# Altium schematic sheet AVR Programmer.SchDoc
size A
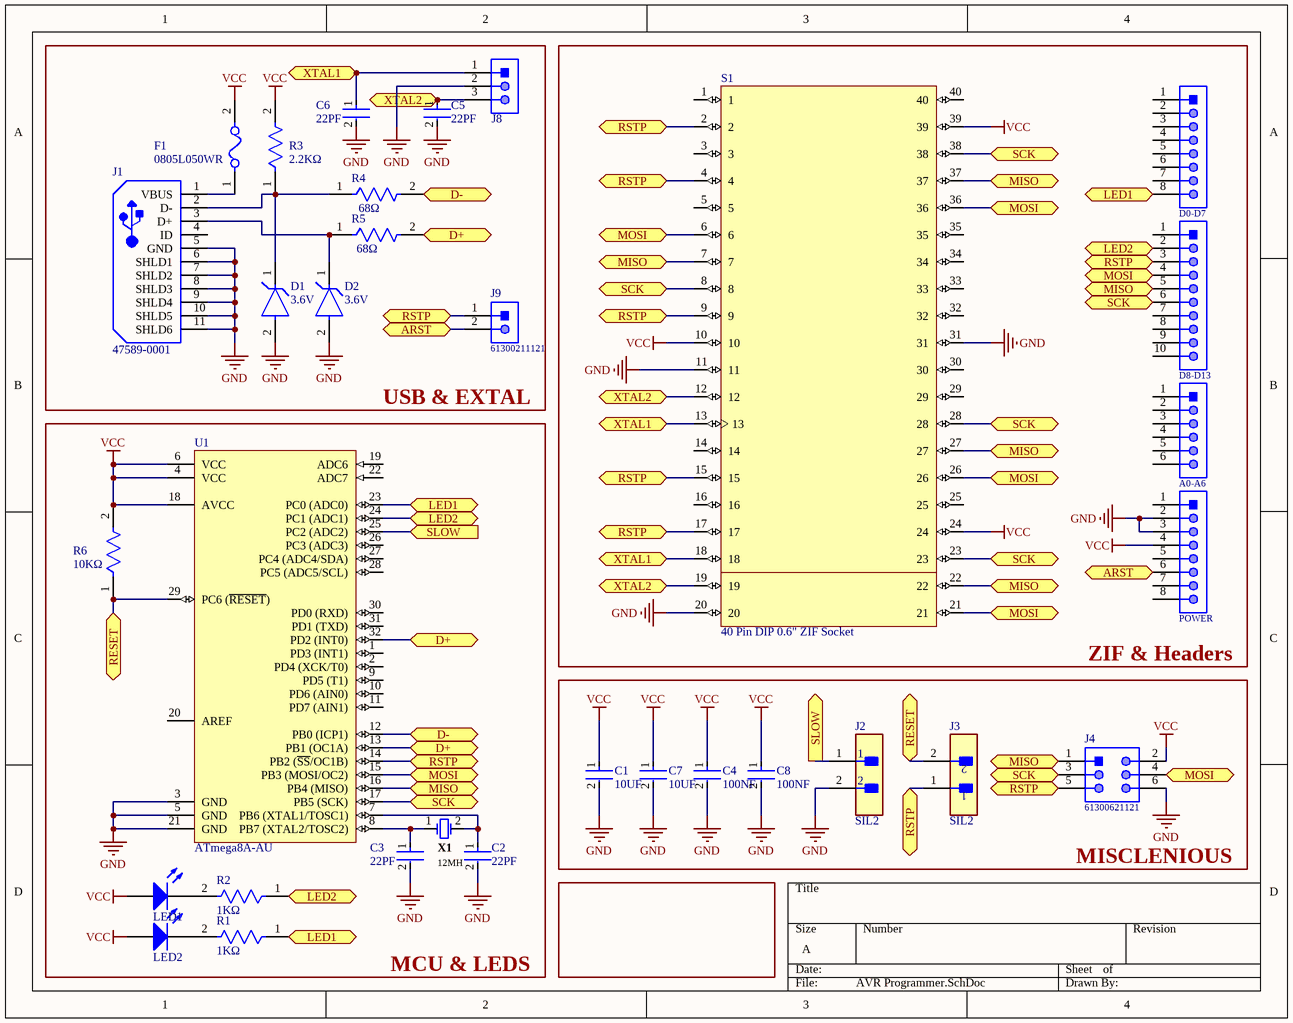
[diagram p0: AVR Programmer.SchDoc]

## Parts
(Parts that share a designator on the sheet are numbered #1, #2 ... from top to bottom, then left to right.)
C1  10UF  [FP-C0805C-DN-MFG]
C2  22PF  [FP-CC0805-0_85-MFG]
C3  22PF  [FP-CC0805-0_85-MFG]
C4  100NF  [FP-C0805C-DN-MFG]
C5  22PF  [FP-CC0805-0_85-MFG]
C6  22PF  [FP-CC0805-0_85-MFG]
C7  10UF  [FP-C0805C-DN-MFG]
C8  100NF  [FP-C0805C-DN-MFG]
D1  3.6V  [FP-6_560-5005_01-4-MFG]
D2  3.6V  [FP-6_560-5005_01-4-MFG]
F1  0805L050WR  [FP-0805L-MFG]
J1  47589-0001  [MOLX-47589-0001_V]
J2  SIL2  [FP-M22-2510205-MFG]
J3  SIL2  [FP-M22-2510205-MFG]
J4#1  D0-D7  [61300811121]
J4#2  61300621121  [61300621121]
J5  D8-D13  [61301011121]
J6  A0-A6  [61300611121]
J7  POWER  [61300811121]
J8  61300311121  [61300311121]  (value not drawn)
J9  61300211121  [61300211121]
LED1  (no value)  [0805_A]
LED2  150080SS75000  [0805_A]  (value not drawn)
R1  1KΩ  [FP-CRCW0805-e3-IPC_C]
R2  1KΩ  [FP-CRCW0805-e3-IPC_C]
R3  2.2KΩ  [FP-CRCW0805-e3-IPC_C]
R4  68Ω  [FP-CRCW0805-e3-IPC_C]
R5  68Ω  [FP-CRCW0805-e3-IPC_C]
R6  10KΩ  [FP-CRCW0805-e3-IPC_C]
S1  40 Pin DIP 0.6" ZIF Socket  [40P6]
U1  ATmega8A-AU  [32A_N]
X1  12MH  [FOX-FOXSLF-2_V]

## Blocks framed on the sheet
USB & EXTAL: C5 C6 D1 D2 F1 J1 J8 J9 R3-R5
ZIF & Headers: J4#1 J5-J7 S1
MCU & LEDS: C2 C3 LED1 LED2 R1 R2 R6 U1 X1
MISCLENIOUS: C1 C4 C7 C8 J2 J3 J4#2

## Ports
ARST (bidir), D+ (bidir), D- (bidir), LED1 (bidir), LED2 (bidir), MISO (bidir), MOSI (bidir), RESET (bidir), RSTP (bidir), SCK (bidir), SLOW (in), SLOW (out), XTAL1 (bidir), XTAL2 (bidir)

## Nets
GND: C1.2 C2.2 C3.2 C4.2 C5.2 C6.2 C7.2 C8.2 D1.2(A) D2.2(A) J1.5(GND) J1.6(SHLD1) J1.7(SHLD2) J1.8(SHLD3) J1.9(SHLD4) J1.10(SHLD5) J1.11(SHLD6) J2.2 J4#2.6 J7.2 J7.3 J8.2 S1.11 S1.20 S1.31 U1.3(GND) U1.5(GND) U1.21(GND)
VCC: C1.1 C4.1 C7.1 C8.1 F1.2 J4#2.2 J7.4 LED1.2(A) LED2.2(A) R3.2 R6.2 S1.10 S1.24 S1.39 U1.4(VCC) U1.6(VCC) U1.18(AVCC)
ARST: J7.6 J9.2 ; port ARST
D+: R5.2 U1.13(PB1_(OC1A)) U1.32(PD2_(INT0)) ; port D+
D-: R4.2 U1.12(PB0_(ICP1)) ; port D-
LED1: J4#1.8 R1.1 U1.23(PC0_(ADC0)) ; port LED1
LED2: J5.2 R2.1 U1.24(PC1_(ADC1)) ; port LED2
MISO: J4#2.1 J5.5 S1.7 S1.22 S1.27 S1.37 U1.16(PB4_(MISO)) ; port MISO
MOSI: J4#2.4 J5.4 S1.6 S1.21 S1.26 S1.36 U1.15(PB3_(MOSI/OC2)) ; port MOSI
RESET: J3.2 R6.1 U1.29(PC6_(~{RESET})) ; port RESET
RSTP: J3.1 J4#2.5 J5.3 J9.1 S1.2 S1.4 S1.9 S1.15 S1.17 U1.14(PB2_(~{SS}/OC1B)) ; port RSTP
SCK: J4#2.3 J5.6 S1.8 S1.23 S1.28 S1.38 U1.17(PB5_(SCK)) ; port SCK
SLOW: J2.1 U1.25(PC2_(ADC2)) ; port SLOW
XTAL1: C6.1 J8.1 S1.13 S1.18 ; port XTAL1
XTAL2: C5.1 J8.3 S1.12 S1.19 ; port XTAL2
NetC2_1: C2.1 U1.7(PB6_(XTAL1/TOSC1)) X1.2
NetC3_1: C3.1 U1.8(PB7_(XTAL2/TOSC2)) X1.1
NetD1_1: D1.1(C) J1.2(D-) R3.1 R4.1
NetD2_1: D2.1(C) J1.3(D+) R5.1
NetF1_1: F1.1 J1.1(VBUS)
NetLED1_1: LED1.1(K) R2.2
NetLED2_1: LED2.1(K) R1.2

Not connected (* = marked no-connect by the designer): J1 4(ID); J4#1 1 2 3 4 5 6 7; J5 1 7 8 9 10; J6 1 2 3 4 5 6; J7 1 5 7 8; S1 1 3 5 14 16 25 29 30 32 33 34 35 40; U1 1(PD3_(INT1)) 2(PD4_(XCK/T0)) 9(PD5_(T1)) 10(PD6_(AIN0)) 11(PD7_(AIN1)) 19(ADC6) 20(AREF) 22(ADC7) 26(PC3_(ADC3)) 27(PC4_(ADC4/SDA)) 28(PC5_(ADC5/SCL)) 30(PD0_(RXD)) 31(PD1_(TXD))

## Library data of the parts
C1 C7 = CMP-2007-00235-2: CAP CER 1000PF 50V C0G/NP0 0805; Manufacturer: KEMET; Manufacturer Part Number: C0805C102J5GACTU; Value: 1,000 pF; Temperature Characteristic: C0G; Material: Ceramic; Temperature Coefficient: 30ppm/°C; Tolerance: 0.05; Automotive: No; Voltage Rating: 50 V; Device Class L1: Passive Components; Digikey Description: CAP CER 1000PF 50V C0G/NP0 0805; Lead Free: Yes; Capacitance: 1,000 pF; Package: C0805C-DN; RoHS: TRUE; Temperature Range High: +125°C; Height: 0.88mm; Ipc Land Pattern Name: CAPC200125X78; Category: Cap; ComponentLink2URL: https://content.kemet.com/datasheets/KEM_C1003_C0G_SMD.pdf; Device Class L2: Capacitors; ComponentLink2Description: Datasheet; Temperature: -55°C to +125°C; Octopart: https://octopart.com/c0805c102j5gactu-kemet-97757; Mouser Description: Multilayer Ceramic Capacitors MLCC - SMD/SMT 50volts 1000pF C0G 5%; Device Class L3: Ceramic Capacitors; Temperature Range Low: -55°C
C2 C3 C5 C6 = CMP-2100-03606-3: CAP CER 0.1UF 50V X7R 0805; Manufacturer Part Number: CC0805KRX7R9BB104; Manufacturer: Yageo; Tolerance: 0.1; Capacitance: 100 nF; Value: 100 nF; Material: Ceramic; Device Class L1: Passive Components; ComponentLink2Description: Datasheet; Package: CC0805-0.85; Digikey Description: CAP CER 0.1UF 50V X7R 0805; Device Class L3: Ceramic Capacitors; Temperature: -30°C to +85°C; Temperature Characteristic: X7R; Voltage Rating: 50 V; Height: 0.95mm; RoHS: TRUE; Ipc Land Pattern Name: CAPC200125X85; Device Class L2: Capacitors; Category: Cap; Temperature Range Low: -30°C; Temperature Range High: +85°C; Mouser Description: Multilayer Ceramic Capacitors MLCC - SMD/SMT 100nF 50V X7R 10%; Footprint Url: http://www.yageo.com/exep/pages/download/literatures/UPY-C_GEN_24.pdf; Automotive: No; Octopart: https://octopart.com/cc0805krx7r9bb104-yageo-192993; Lead Free: Yes; ComponentLink2URL: http://www.yageo.com/documents/recent/UPY-GPHC_Y5V_6.3V-to-50V_8.pdf
C4 C8 = CMP-2007-00403-2: CAP CER 680PF 50V X7R 0805; Manufacturer Part Number: C0805C681K5RACTU; Manufacturer: KEMET; Material: Ceramic; Temperature Coefficient: 30ppm/°C; Tolerance: 0.1; Voltage Rating: 50 V; Temperature Range High: +125°C; Temperature Characteristic: X7R; Value: 680 pF; Mouser Description: 0805 C 680pF Ceramic Multilayer Capacitor; 50 VDC; +125degC; X7R Dielec; +/-10%; Automotive: No; Octopart: https://octopart.com/c0805c681k5ractu-kemet-124671; RoHS: TRUE; Device Class L2: Capacitors; Height: 0.88mm; Capacitance: 680 pF; Category: Cap; Ipc Land Pattern Name: CAPC200125X78; Lead Free: Yes; Temperature: -55°C to +125°C; Package: C0805C-DN; Device Class L3: Ceramic Capacitors; Temperature Range Low: -55°C; ComponentLink2URL: https://content.kemet.com/datasheets/KEM_C1003_C0G_SMD.pdf; ComponentLink2Description: Datasheet; Digikey Description: CAP CER 680PF 50V X7R 0805; Device Class L1: Passive Components
D1 D2 = CMP-02541-000010-1: DIODE ZENER 5.1V 500MW SOD80; Manufacturer: Vishay Semiconductor Diodes Division; Manufacturer Part Number: TZMC5V1-GS08; Zener Impedance: 60Ω; Reverse Voltage: 1V; Max Reverse Leakage Current: 0.1uA; Max Junction Temp: +175°C; Forward Current: 200mA; Automotive Grade: Grade 0; Max Zener Voltage: 5.4V; Device Class L2: Diodes; RoHS: TRUE; Octopart: https://octopart.com/tzmc5v1-gs08-vishay-1003274; ComponentLink2Description: Datasheet; Mouser Description: TZM Series 500 mW 5.1 V 200 mA Small Signal Zener Diode - SOD-80; Height: 1.6mm; Nom Zener Voltage: 5.1V; Lead Free: Yes; Category: Diode; Power Dissipation: 500mW; Device Class L1: Discrete Semiconductors; Package: 6.560-5005.01-4; ComponentLink2URL: https://www.vishay.com/docs/84122/tzm.pdf; Digikey Description: DIODE ZENER 5.1V 500MW SOD80; Automotive: Yes; Device Class L3: Zener Diodes; Temperature Range High: +175°C; Temperature: to +175°C
F1 = CMP-08606-000023-1: PTC RESET FUSE 6V 500MA 0805; Manufacturer: Littelfuse Inc.; Current Rating: 100A; Hold Current: 0.5A; Value: 0.15-0.85Ω; Trip Time: 0.1s; Trip Current: 1A; Device Class L2: PTC Resettable Fuses; Manufacturer Part Number: 0805L050WR; Digikey Description: PTC RESET FUSE 6V 500MA 0805; ComponentLink2URL: https://www.littelfuse.com/~/media/electronics/datasheets/resettable_ptcs/littelfuse_ptc_0805l_datasheet.pdf.pdf; Package: 0805L; RoHS: TRUE; Temperature Range Low: -40°C; Octopart: https://octopart.com/0805l050wr-littelfuse-673858; Resistance: 0.15-0.85Ω; ComponentLink2Description: Datasheet; Category: Fuse; Height: 1.25mm; Mouser Description: PTC Resettable Fuse 0.5A(hold) 1A(trip) 6VDC 100A 0.5W 0.1s 0.15Ohm SMD Solder Pad 0805 T/R; Ambient Temperature Range High: +85°C; Automotive: No; Device Class L3: unset; Lead Free: Yes; Temperature: -40°C to +85°C; Voltage Rating: 6V; Ambient Temperature Range Low: -40°C; Temperature Range High: +85°C; Device Class L1: Circuit Protection
J1 = CMP-2000-05610-1: Right Angle Female Type AB Micro USB Connector, 30 V, 1.8 A, -30 to 85 degC, RoHS, Tape and Reel; Number of Ports: 1Port; Current Rating: 1.8A; Brand: Molex; Connector Type: MicroUSBTypeABreceptacle; Number of Contacts: 5Contact; Voltage Rating: 30VAC; Color: Black; Product: MicroUSBTypeABConnectors; Package URL: http://www.molex.com/pdm_docs/sd/475890001_sd.pdf; Contact Plating: Gold; Datasheet URL: http://www.molex.com/webdocs/datasheets/pdf/en-us/0475890001_IO_CONNECTORS.pdf; Operating Temperature Range: -20Cto+85C; Termination Style: SMD/SMT; Mounting Angle: Right; Package Reference: 47589-0001; Gender: Female; Package Description: Micro USB Connector, Pitch 0.65 mm, 5 Positions, Body 7.5 x 5.6 mm; Mounting Technology: SurfaceMount; Contact Material: CopperAlloy; Packaging: Reel; RoHS: True; Standard: USB; Manufacturer URL: http://www.molex.com/; Manufacturer: Molex; Datasheet Version: 12/2016; Product Category: USBConnectors; Series: 47589
J2 J3 = CMP-15831-000005-1: CONN HEADER VERT 2POS 2MM; Manufacturer: Harwin; Manufacturer Part Number: M22-2510205; Conn Gender: Male; Current Rating: 2A; Number Of Contacts: 2; Conn Orientation: Vertical; Temperature Range Low: -40°C; Device Class L1: Connectors; ComponentLink2URL: https://cdn.harwin.com/pdfs/C018XX_M22_Series_Connectors.pdf; Temperature Range High: +105°C; Pitch: 2mm; Number Of Rows: 1; Temperature: -40°C to +105°C; Automotive: No; Device Class L3: unset; Octopart: https://octopart.com/m22-2510205-harwin-2538221; Mouser Description: Headers & Wire Housings 2 PIN SIL VERTICAL GOLD PIN HEADER; Height: 5.45mm; Category: Conn; Digikey Description: CONN HEADER VERT 2POS 2MM; Contact Material: Gold,Nickel; Lead Free: Yes; ComponentLink2Description: Datasheet; Device Class L2: Headers and Wire Housings; Package: 0; Footprint Url: https://cdn.harwin.com/pdfs/M22-251.pdf; RoHS: TRUE
J4#1 J7 = CMP-1502-01076-1: THT Vertical Pin Header WR-PHD, Pitch 2.54 mm, Single Row, 8 pins; Manufacturer: Wurth Elektronik; Rated Current: 3A; Pin Number: 8; Working Voltage: 250VAC; Gender: Male; Contact Resistance: 20mOhm; Pitch: 2.54mm; Withstanding Voltage: 500VAC; Publisher: WurthElektronik; Operating Temperature: -40to105degC; Orientation: Vertical; Row Number: Single; Part Number: 61300811121; Package Reference: 61300811121; Mounting Technology: THT; Packaging: Bag; Manufacturer URL: http://www.we-online.de; Datasheet URL: https://katalog.we-online.de/em/datasheet/6130xx11121.pdf
J4#2 = CMP-1502-01072-1: THT Vertical Pin Header WR-PHD, Pitch 2.54 mm, Dual Row, 6 pins; Manufacturer: Wurth Elektronik; Contact Resistance: 20mOhm; Withstanding Voltage: 500VAC; Pin Number: 6; Gender: Male; Pitch: 2.54mm; Working Voltage: 250VAC; Rated Current: 3A; Packaging: Bag; Row Number: Dual; Manufacturer URL: http://www.we-online.de; Part Number: 61300621121; Operating Temperature: -40to105degC; Mounting Technology: THT; Package Reference: 61300621121; Datasheet URL: https://katalog.we-online.de/em/datasheet/6130xx21121.pdf; Orientation: Vertical; Publisher: WurthElektronik
J5 = CMP-1502-01082-1: THT Vertical Pin Header WR-PHD, Pitch 2.54 mm, Single Row, 10 pins; Manufacturer: Wurth Elektronik; Contact Resistance: 20mOhm; Rated Current: 3A; Pitch: 2.54mm; Gender: Male; Pin Number: 10; Working Voltage: 250VAC; Withstanding Voltage: 500VAC; Manufacturer URL: http://www.we-online.de; Operating Temperature: -40to105degC; Datasheet URL: https://katalog.we-online.de/em/datasheet/6130xx11121.pdf; Row Number: Single; Orientation: Vertical; Part Number: 61301011121; Packaging: Bag; Package Reference: 61301011121; Mounting Technology: THT; Publisher: WurthElektronik
J6 = CMP-1502-01070-1: THT Vertical Pin Header WR-PHD, Pitch 2.54 mm, Single Row, 6 pins; Manufacturer: Wurth Elektronik; Gender: Male; Pin Number: 6; Pitch: 2.54mm; Working Voltage: 250VAC; Rated Current: 3A; Withstanding Voltage: 500VAC; Contact Resistance: 20mOhm; Operating Temperature: -40to105degC; Packaging: Bag; Datasheet URL: https://katalog.we-online.de/em/datasheet/6130xx11121.pdf; Package Reference: 61300611121; Mounting Technology: THT; Publisher: WurthElektronik; Part Number: 61300611121; Manufacturer URL: http://www.we-online.de; Row Number: Single; Orientation: Vertical
J8 = CMP-1502-01062-1: THT Vertical Pin Header WR-PHD, Pitch 2.54 mm, Single Row, 3 pins; Manufacturer: Wurth Elektronik; Withstanding Voltage: 500VAC; Working Voltage: 250VAC; Rated Current: 3A; Pitch: 2.54mm; Pin Number: 3; Gender: Male; Contact Resistance: 20mOhm; Package Reference: 61300311121; Manufacturer URL: http://www.we-online.de; Datasheet URL: https://katalog.we-online.de/em/datasheet/6130xx11121.pdf; Operating Temperature: -40to105degC; Part Number: 61300311121; Orientation: Vertical; Packaging: Bag; Row Number: Single; Mounting Technology: THT; Publisher: WurthElektronik
J9 = CMP-1712-00002-4: THT Vertical Pin Header WR-PHD, Pitch 2.54 mm, Single Row, 2 pins; Manufacturer: Wurth Elektronik; Rated Current: 3A; Gender: Male; Withstanding Voltage: 500VAC; Working Voltage: 250VAC; Pitch: 2.54mm; Contact Resistance: 20mOhm; Pin Number: 2; Mounting Technology: THT; Orientation: Vertical; Operating Temperature: -40to105degC; Packaging: Bag; Publisher: WurthElektronik; Datasheet URL: https://katalog.we-online.de/em/datasheet/6130xx11121.pdf; Manufacturer URL: http://www.we-online.de; Row Number: Single; Package Reference: 61300211121; Part Number: 61300211121
LED1 = CMP-1426-00010-1: SMD mono-color Chip LED, WL-SMCW, Super Red; Manufacturer: Wuerth Elektronik; PartNumber: 150080SS75000; PackageReference: 0805_A; ComponentLink2URL: http://katalog.we-online.com/led/datasheet/150080SS75000.pdf; ComponentLink1URL: http://www.we-online.com; Color: Super Red; ComponentLink2Description: Datasheet; ComponentLink1Description: Manufacturer URL
LED2 = CMP-1426-00010-1: SMD mono-color Chip LED, WL-SMCW, Super Red; Manufacturer: Wuerth Elektronik; PackageReference: 0805_A; ComponentLink2URL: http://katalog.we-online.com/led/datasheet/150080SS75000.pdf; ComponentLink1URL: http://www.we-online.com; Color: Super Red; ComponentLink2Description: Datasheet; ComponentLink1Description: Manufacturer URL; PartNumber: 150080SS75000
R1-R4 R6 = CMP-2001-04979-2: RES Thick Film, 68Ω, 1%, 0.125W, 100ppm/°C, 0805; Voltage Rating: 150V; Power Rating: 125mW; Resistance: 16kR; Contact Plating: Tin; Case Code (Imperial): 0805; Tolerance: 1%; Weight: 0.000194oz; Height: 0.45mm; Max Power Dissipation: 125mW; Lead Free: Lead Free; Number of Pins: 2; Composition: Thick Film; Package Quantity: 10; Max Operating Temperature: 155°C; Length: 2mm; Width: 1.25mm; Voltage Rating (DC): 150V; Packaging: Tape and Reel; Termination: SMD/SMT; Depth: 1.25mm; Mount: Surface Mount; Temperature Coefficient: 100ppm/°C; Features: Automotive AEC-Q200; Military Standard: Not; Case Code (Metric): 2012; Radiation Hardening: No; Number of Terminations: 2; Min Operating Temperature: -55°C; Case/Package: 0805
R5 = CMP-2001-04979-2: RES Thick Film, 16kΩ, 1%, 0.125W, 100ppm/°C, 0805; Voltage Rating: 150V; Power Rating: 125mW; Resistance: 16kR; Contact Plating: Tin; Case Code (Imperial): 0805; Tolerance: 1%; Weight: 0.000194oz; Height: 0.45mm; Max Power Dissipation: 125mW; Lead Free: Lead Free; Number of Pins: 2; Composition: Thick Film; Package Quantity: 10; Max Operating Temperature: 155°C; Length: 2mm; Width: 1.25mm; Voltage Rating (DC): 150V; Packaging: Tape and Reel; Termination: SMD/SMT; Depth: 1.25mm; Mount: Surface Mount; Temperature Coefficient: 100ppm/°C; Features: Automotive AEC-Q200; Military Standard: Not; Case Code (Metric): 2012; Radiation Hardening: No; Number of Terminations: 2; Min Operating Temperature: -55°C; Case/Package: 0805
S1 = CMP-0095-00014-2: 8-bit AVR Microcontroller, 32KB Flash, 1KB EEPROM, 2KB SRAM, 40-pin PDIP, Industrial Grade (-40°C to 85°C); Code_JEDEC: MS-011-AC; PackageVersion: revB, Sep-2001; ComponentLink1URL: http://www.atmel.com/; DatasheetVersion: revC, Jun-2011; RevisionNote: DatasheetVersion & Sch pin names updated. URLs added.; ComponentLink2URL: http://www.atmel.com/dyn/resources/prod_documents/doc8272.pdf; PackageReference: 40P6; ComponentLink1Description: Manufacturer URL; ComponentLink3URL: http://www.atmel.com/dyn/resources/prod_documents/8272S.pdf; PackageDescription: 40-lead (0.600"/15.24mm Wide) Plastic Dual Inline Package (PDIP); ComponentLink3Description: ATmega164A/164PA/324A/324PA/644A/644PA/1284/1284P Summary; ComponentLink2Description: ATmega164A/164PA/324A/324PA/644A/644PA/1284/1284P Datasheet
U1 = CMP-0095-00219-2: 8-bit AVR Microcontroller, 2.7-5.5V, 16MHz, 8KB Flash, 512 Bytes EEPROM, 1KB SRAM, 32-pin TQFP, Industrial Grade (-40°C to 85°C); Code_JEDEC: MS-026-ABA; ComponentLink3URL: http://www.atmel.com/dyn/resources/prod_documents/8159S.pdf; PackageDescription: 32-Lead, 7x7x1.0 mm Body, 0.8mm Lead Pitch, Thin Profile Plastic Quad Flat Package (TQFP); DatasheetVersion: revD, Feb-2011; PackageVersion: revC, Oct-2010; ComponentLink2URL: http://www.atmel.com/dyn/resources/prod_documents/doc8159.pdf; RevisionNote: DatasheetVersion & PackageVersion updated. URLs added.; PackageReference: 32A; ComponentLink3Description: ATmega8A Summary; ComponentLink2Description: ATmega8A Datasheet; ComponentLink1Description: Manufacturer URL; ComponentLink1URL: http://www.atmel.com/
X1 = CMP-1749-00004-1: Resistance Weld Thru-Hole Crystal, 12 MHz, +/-30 ppm, -20 to 70 degC, 2-Pin THD, RoHS, Bulk; Elements: 1; Rds On Max: 115 mohm; Typical Rise Time: 90 ns; Max Power Dissipation: 2.5 W; Case\Package: TO-251-3; Input Capacitance: 350 pF; REACH SVHC: No SVHC; Length: 6.6 mm; ComponentLink1URL: http://www.foxonline.com/; PackageDescription: 2-Pin Through Hole Device, Body 11.35 x 4.65 mm, Pitch 4.88 mm; Radiation Hardening: No; Package Quantity: 70; Packaging: Rail/Tube; ComponentLink1Description: Manufacturer URL; Min Operating Temperature: -55 degC; Max Operating Temperature: 150 degC; RoHSCompliant: true; PackageReference: FOXSLF-2; DatasheetVersion: Mar-15; Pins: 3; Height: 6.1 mm; Mount: Through Hole; ComponentLink2URL: http://www.foxonline.com/pdfs/hc49slf.pdf; ComponentLink2Description: Datasheet; Width: 2.3 mm